# Altium schematic sheet TCAN1146_PWR_MGMT.SchDoc
size C; SheetNumber: 18; SheetTotal: 24
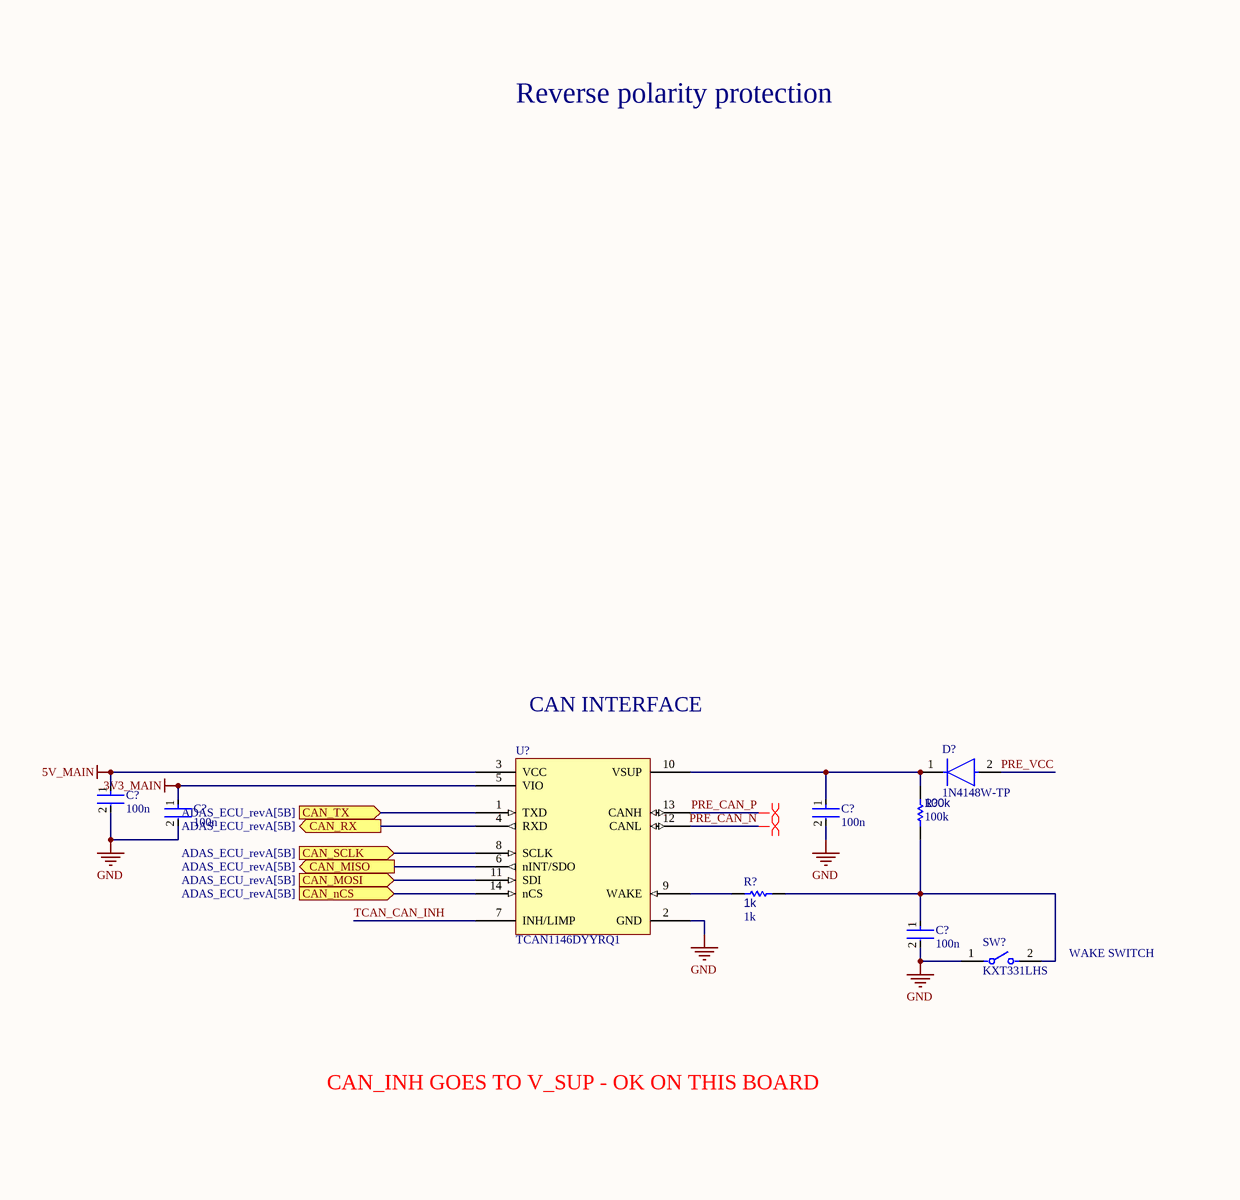
[diagram p0: TCAN1146_PWR_MGMT.SchDoc, left]
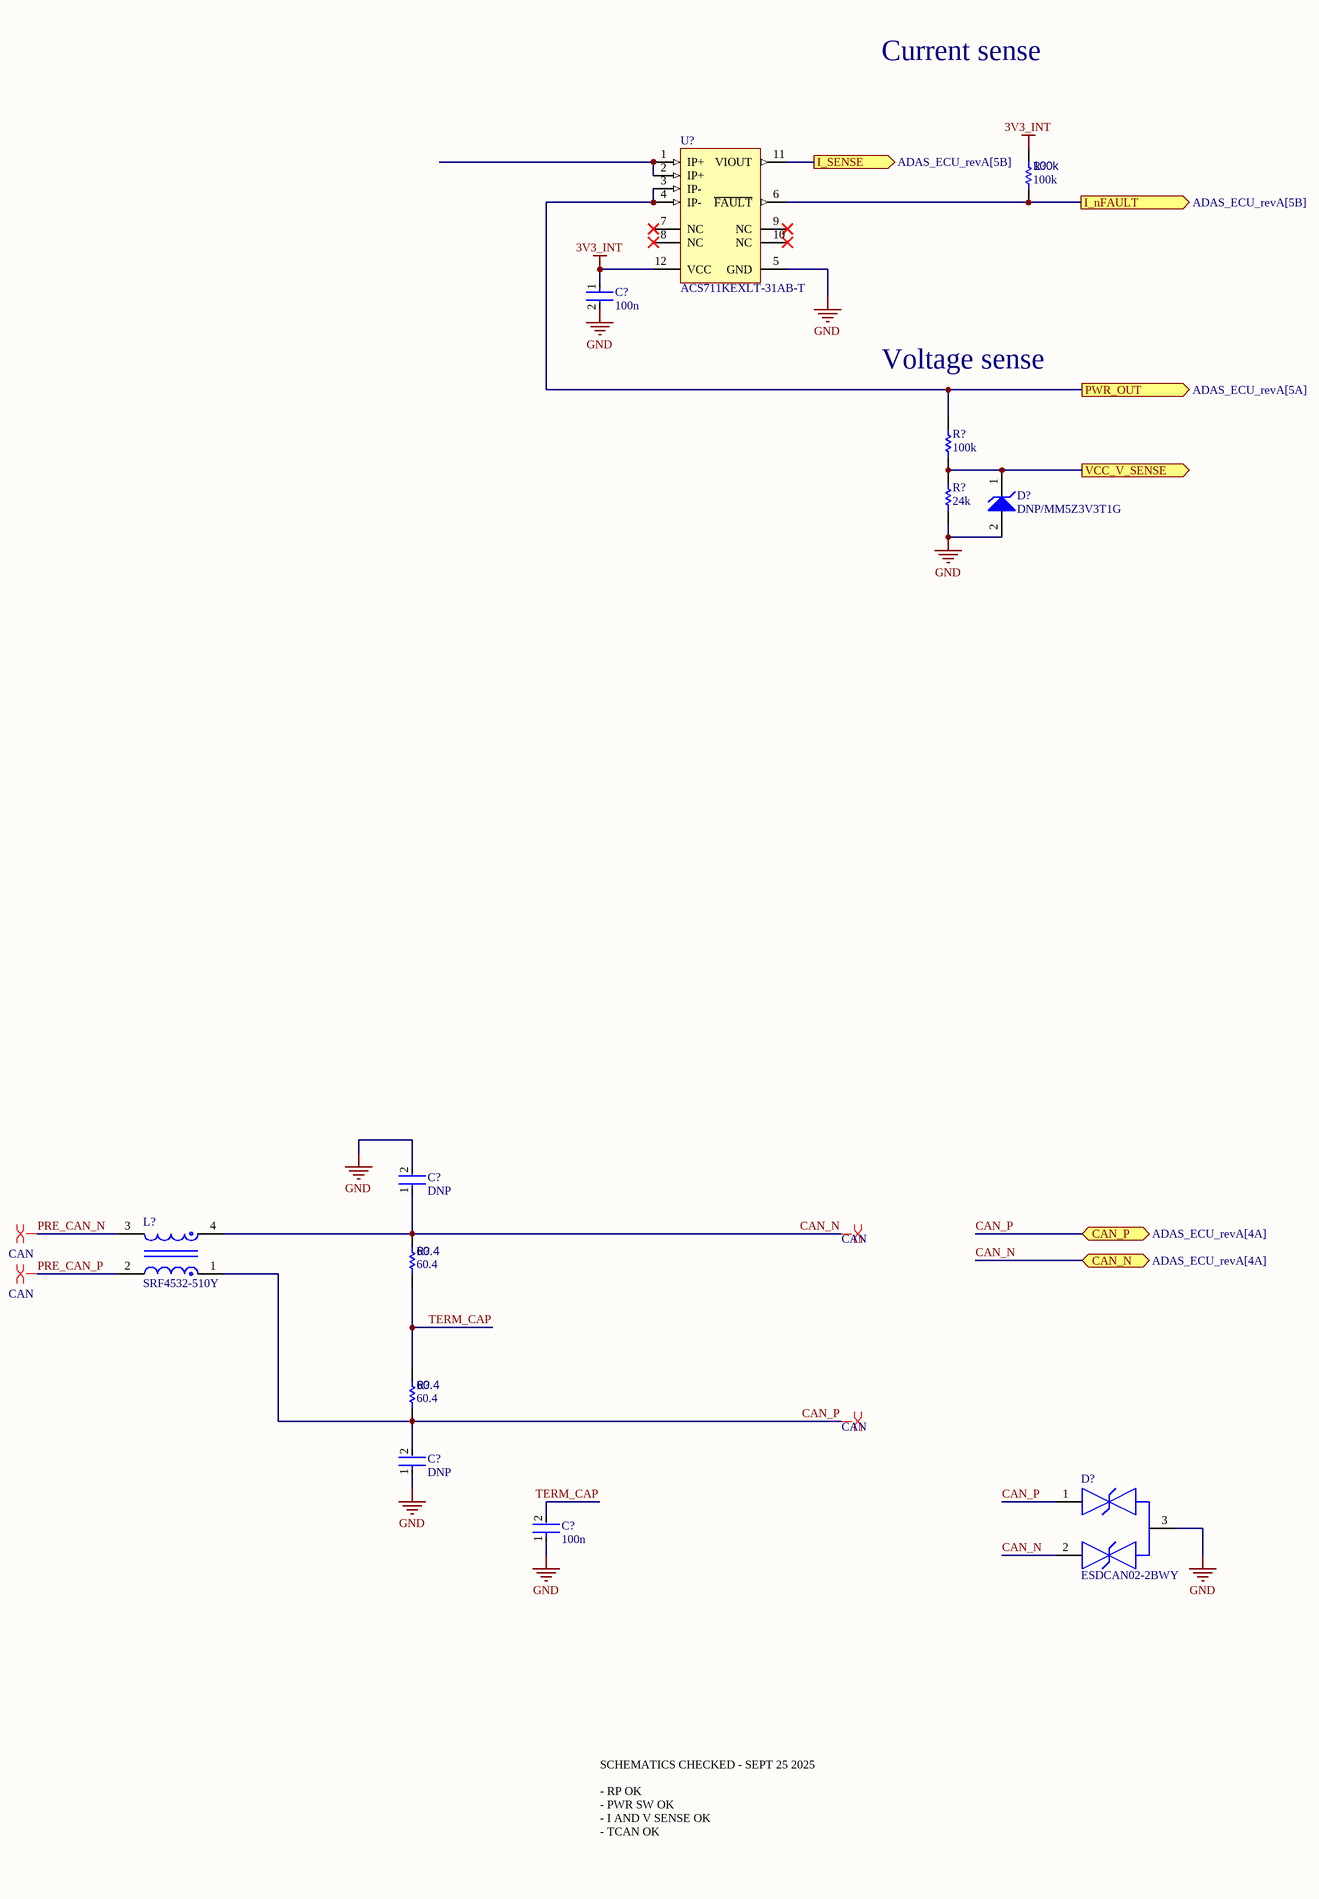
[diagram p1: TCAN1146_PWR_MGMT.SchDoc, right]

## Parts
(Parts that share a designator on the sheet are numbered #1, #2 ... from top to bottom, then left to right.)
C?#1  100n  [FP-0402-L_1_0_0_05-W_0_5-IPC_A]
C?#2  100n  [FP-0402-L_1_0_0_05-W_0_5-IPC_A]
C?#3  100n  [FP-0402-L_1_0_0_05-W_0_5-IPC_A]
C?#4  100n  [FP-0402-L_1_0_0_05-W_0_5-IPC_A]
C?#5  DNP  [FP-0402-L_1_0_0_05-W_0_5-IPC_A]
C?#6  100n  [FP-0402-L_1_0_0_05-W_0_5-IPC_A]
C?#7  DNP  [FP-0402-L_1_0_0_05-W_0_5-IPC_A]
C?#8  100n  [FP-0402-L_1_0_0_05-W_0_5-IPC_A]
D?#1  DNP/MM5Z3V3T1G  [ONSC-SOD-523-2-502-01_V]
D?#2  1N4148W-TP  [FP-SOD-123-IPC_A]
D?#3  ESDCAN02-2BWY  [FP-SOT323-3L-MFG]
L?  SRF4532-510Y  [FP-SRF4532-MFG]
R?#1  100k  [R0603B]
R?#2  100k  [R0603B]
R?#3  24k  [R0603B]
R?#4  100k  [R0603B]
R?#5  1k  [R0603B]
R?#6  60.4  [R0603B]
R?#7  60.4  [R0603B]
SW?  KXT331LHS  [FP-KXT331LHS-MFG]
U?#1  ACS711KEXLT-31AB-T  [ALEG-EX-12_V]
U?#2  TCAN1146DYYRQ1  [TCAN1146DYYRQ1-Footprint-1]

## Ports
CAN_MISO (out, see ADAS_ECU_revA[5B]), CAN_MOSI (in, see ADAS_ECU_revA[5B]), CAN_N (bidir, see ADAS_ECU_revA[4A]), CAN_nCS (in, see ADAS_ECU_revA[5B]), CAN_P (bidir, see ADAS_ECU_revA[4A]), CAN_RX (out, see ADAS_ECU_revA[5B]), CAN_SCLK (in, see ADAS_ECU_revA[5B]), CAN_TX (in, see ADAS_ECU_revA[5B]), I_nFAULT (out, see ADAS_ECU_revA[5B]), I_SENSE (out, see ADAS_ECU_revA[5B]), PWR_OUT (out, see ADAS_ECU_revA[5A]), VCC_V_SENSE (out)

## Nets
3V3_INT: C?#1.1 R?#1.2 U?#1.12(VCC)
3V3_MAIN: C?#3.1 U?#2.5(VIO)
5V_MAIN: C?#2.1 U?#2.3(VCC)
GND: C?#1.2 C?#2.2 C?#3.2 C?#4.2 C?#5.2 C?#6.2 C?#7.1 C?#8.1 D?#1.2(A) D?#3.3 R?#3.1 SW?.1 U?#1.5(GND) U?#2.2(GND)
CAN_MISO: U?#2.6(nINT/SDO) ; port CAN_MISO
CAN_MOSI: U?#2.11(SDI) ; port CAN_MOSI
CAN_N: C?#5.1 D?#3.2 L?.4 R?#6.2 ; port CAN_N
CAN_nCS: U?#2.14(nCS) ; port CAN_nCS
CAN_P: C?#7.2 D?#3.1 L?.1 R?#7.1 ; port CAN_P
CAN_RX: U?#2.4(RXD) ; port CAN_RX
CAN_SCLK: U?#2.8(SCLK) ; port CAN_SCLK
CAN_TX: U?#2.1(TXD) ; port CAN_TX
I_nFAULT: R?#1.1 U?#1.6(~{FAULT}) ; port I_nFAULT
I_SENSE: U?#1.11(VIOUT) ; port I_SENSE
PRE_CAN_N: L?.3 U?#2.12(CANL)
PRE_CAN_P: L?.2 U?#2.13(CANH)
PRE_VCC: D?#2.2(A)
PWR_OUT: R?#2.2 U?#1.3(IP-) U?#1.4(IP-) ; port PWR_OUT
TCAN_CAN_INH: U?#2.7(INH/LIMP)
TERM_CAP: C?#8.2 R?#6.1 R?#7.2
VCC_V_SENSE: D?#1.1(K) R?#2.1 R?#3.2 ; port VCC_V_SENSE
NetC?#4_1: C?#4.1 D?#2.1(C) R?#4.2 U?#2.10(VSUP)
NetC?#6_1: C?#6.1 R?#4.1 R?#5.2 SW?.2
NetR?#5_1: R?#5.1 U?#2.9(WAKE)
NetU?#1_1: U?#1.1(IP+) U?#1.2(IP+)

Not connected (* = marked no-connect by the designer): U?#1 7(NC)* 8(NC)* 9(NC)* 10(NC)*

## Layout directives
differential pair: PRE_CAN_N, PRE_CAN_P
differential pair; differential pair class CAN: CAN_N, CAN_P, PRE_CAN_N, PRE_CAN_P

## Notes on the sheet
- Current sense
- Voltage sense
- Reverse polarity protection
- CAN INTERFACE
- WAKE SWITCH
- CAN_INH GOES TO V_SUP - OK ON THIS BOARD
- SCHEMATICS CHECKED - SEPT 25 2025
  - RP OK
  - PWR SW OK
  - I AND V SENSE OK
  - TCAN OK

## Library data of the parts
C?#1-C?#8 = CMP-001-00058-1: LARGE PADS, 0402 CAP, CHANGE COMMENT TO MATCH REAL P/N; Capacitor Type: Ceramic; Min Operating Temperature: -55°C; Mounting Technology: Surface Mount; Pins: 2; Case/Package: 0402; RoHS Compliant: Yes; Max Operating Temperature: 85°C
D?#1 = CMP-1060-00750-1: Zener Voltage Regulator, 500 mW, 2-Pin SOD-523, Pb-Free, Tape and Reel; Manufacturer: On Semiconductor; P Max (W): 0.5; VZ Typ (V): 3.3; RoHS: Pb-Free; ComponentLink2Description: Datasheet; PackageReference: SOD-523-2-502-01; DatasheetVersion: Rev. 10; ComponentLink1Description: Manufacturer URL; PackageVersion: Rev. E, 09/2010; ComponentLink3URL: http://www.onsemi.com/pub_link/Collateral/502-01.PDF; ComponentLink2URL: http://www.onsemi.cn/pub_link/Collateral/MM5Z2V4T1-D.PDF; Mounting Technology: Surface Mount; PartNumber: MM5Z3V3T1G; Packing: Tape and Reel; PackageDescription: 2-Pin SOD, Body 1.2 x 0.8 mm; ComponentLink1URL: http://www.onsemi.com/; ComponentLink3Description: Package Specification
D?#2 = CMP-2000-04993-2: DIODE GEN PURP 100V 150MA SOD123; Max Reverse Leakage Current: 5uA; Max Surge Current: 2A; Reverse Recovery Time: 4ns; Polarity: Standard; Capacitance: 4pF; Max Forward Surge Current (Ifsm): 1A; Element Configuration: Single; Power Dissipation: 400mW; Forward Voltage: 1V; Radiation Hardening: No; Lead Free: Lead Free; Max Reverse Voltage (DC): 100V; Current Rating: 150mA; Forward Current: 150mA; Packaging: Tape and Reel; Number of Pins: 2; Package Quantity: 3000; Max Operating Temperature: 150°C; Min Operating Temperature: -65°C; Average Rectified Current: 150mA; Recovery Time: 4ns; Output Current: 150mA; Peak Non-Repetitive Surge Current: 2A; Width: 1.8mm; Voltage Rating (DC): 100V; Height: 1.2mm; Max Repetitive Reverse Voltage (Vrrm): 100V; Mount: Surface Mount; Length: 2.85mm
D?#3 = CMP-12225-000055-1: TVS DIODE 26.5V 44V SOT323-3; Manufacturer: STMicroelectronics; Value: 3pF; Direction: Bidirectional; Breakdown Voltage: 28.5V; Automotive Grade: Grade 0; Standoff Height: 0mm; Peak Pulse Power: 170W; Peak Pulse Current: 3A; Number Of Channels: 2; Max Junction Temp: +175°C; Mouser Description: TVS Diodes / ESD Suppressors Automotive dual-line Transil, Transient voltage suppressor (TVS) for CAN bus; Height: 1.1mm; Category: Diode; Reverse Standoff Voltage: 26.5V; Device Class L1: Circuit Protection; Temperature: -55°C to +175°C; RoHS: TRUE; ComponentLink2URL: https://www.st.com/resource/en/datasheet/esdcan02-2bwy.pdf; Device Class L3: unset; Device Class L2: TVS Diodes; Temperature Range High: +175°C; Octopart: https://octopart.com/esdcan02-2bwy-stmicroelectronics-58631133; Ipc Land Pattern Name: SOT65P210X95-3; Temperature Range Low: -55°C; Capacitance: 3pF; Digikey Description: TVS DIODE 26.5V 44V SOT323-3; Automotive: Yes; ComponentLink2Description: Datasheet; Clamping Voltage: 44V; Manufacturer Part Number: ESDCAN02-2BWY; Lead Free: Yes; Package: SOT323-3L
L? = CMP-07251-000006-1: CMC 51UH 200MA 2LN 2KOHM SMD; Element Configuration: Dual; Number of Lines: 2; Core Material: Ferrite; Impedance: 2kR; Test Frequency: 100kHz; Voltage Rating (DC): 50V; Insulation Resistance: 10MR; Material: Steel; Tolerance: 50%; DC Resistance (DCR): 3.5R; RoHS Compliant: Yes; Mount: Surface Mount; REACH SVHC: No SVHC; Termination: SMD/SMT; DC Current: 200mA; Current: 200mA; Lead Free: Lead Free; Contact Plating: Tin; Length: 4.5mm; Max DC Current: 200mA; Width: 0.126inch; Case/Package: 4532; Packaging: Tape and Reel; Package Quantity: 1; Min Operating Temperature: -40°C; Depth: 3.4mm; Series: SRF4532; Max Operating Temperature: 125°C; Current Rating: 200mA; Self Resonant Frequency: 100kHz; Height: 0.118inch; Inductance: 51uH; Resistance: 2kR
R?#1-R?#7 = CMP-009-00002-14: Resistor
  R?#1 R?#2 R?#4: Value: 100k
  R?#3: Value: 24k
  R?#5: Value: 1k
  R?#6 R?#7: Value: 60.4
SW? = CMP-10040-000029-1: SWITCH TACTILE SPST-NO 0.02A 15V; Operating Force: 240gf; Switch Travel: 0.13mm; Illumination Type: Non-Illuminated; Throw Configuration: SPST; Number of Ports: 1; Current Rating: 5A; Mechanical Life: 500000Cycles; Switch Function: Off-Mom; Connector Type: USB; Actuator Type: Standard; Gender: Receptacle; Number of Contacts: 24; Contact Plating: Gold; Insulation Color: Black; Min Operating Temperature: -40°C; Packaging: Tape and Reel; Flammability Rating: UL94 V-0; Max Operating Temperature: 85°C; Termination: Solder; Mount: Surface Mount
U?#1 = CMP-1557-00002-1: Hall Effect Linear Current Sensor with Overcurrent Fault Output for <100 V Isolation Applications, 3 to 5.5 V, -31 to 31 A IP, -40 to 125 degC, 12-Pin QFN (EX), RoHS, Tape and Reel; IP Max: 31 A; VCC Min: 3 V; -3dB Bandwidth: 0.1 MHz; VCC Max: 5.5 V; IP Min: -31 A; Mounting Technology: Surface Mount; DatasheetVersion: Rev. 3; Temperature Min: -40 degC; ComponentLink1Description: Manufacturer URL; Packing: Tape and Reel; PartNumber: ACS711KEXLT-31AB-T; Temperature Max: 125 degC; ComponentLink2Description: Datasheet; ComponentLink3Description: Package Specification; RoHS: TRUE; ComponentLink1URL: http://www.allegromicro.com/; ComponentLink2URL: http://www.allegromicro.com/~/media/Files/Datasheets/ACS711-Datasheet.ashx?la=en; PackageDescription: 12-Pin Quad Flat No-Lead, Body 3 x 3 mm, Height 0.8 mm; ComponentLink3URL: http://www.allegromicro.com/~/media/Files/Datasheets/ACS711-Datasheet.ashx?la=en
U?#2 = CMP-318-000000-2: Automotive CAN FD transceiver with watchdog, bus diagnostics and partial networking via sele 14-SOT-23-THIN -40 to 150; Component Type: Standard; Design Item ID: CMP-015-00012-2; Pin Count: 14; Source: TCAN1146DYYRQ1.SchLib